# EAGLE design relay (EAGLE 5.12)
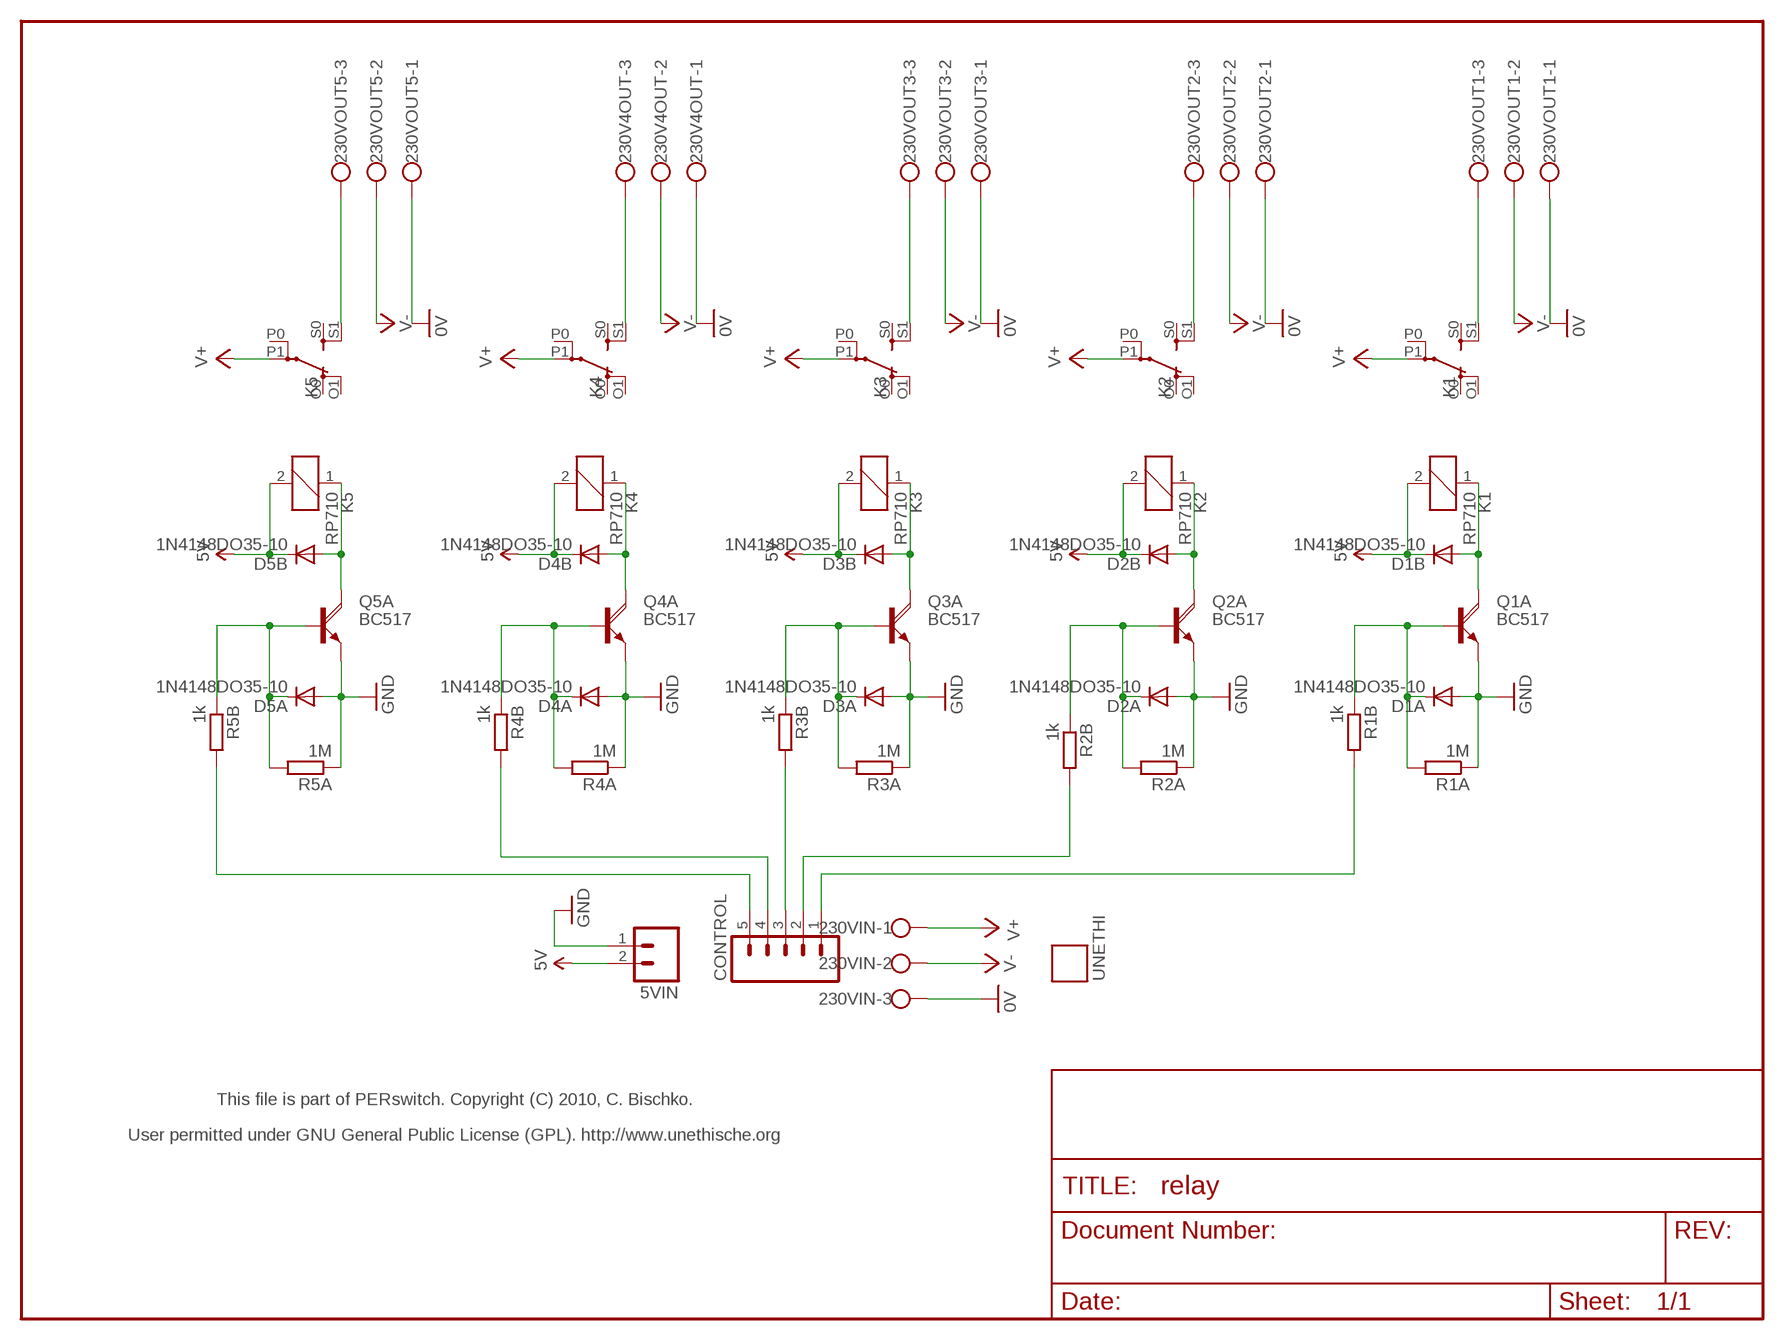
[diagram p0: schematic, sheet 1]

## Parts
5VIN  M02  [1X02_LONGPADS]
230V4OUT  W237-103  [W237-103]
230VIN  W237-103  [W237-103]
230VOUT1  W237-103  [W237-103]
230VOUT2  W237-103  [W237-103]
230VOUT3  W237-103  [W237-103]
230VOUT5  W237-103  [W237-103]
CONTROL  M05PTH_LONGPADS  [1X05_LONGPADS]
D1A  1N4148DO35-10  [DO35-10]
D1B  1N4148DO35-10  [DO35-10]
D2A  1N4148DO35-10  [DO35-10]
D2B  1N4148DO35-10  [DO35-10]
D3A  1N4148DO35-10  [DO35-10]
D3B  1N4148DO35-10  [DO35-10]
D4A  1N4148DO35-10  [DO35-10]
D4B  1N4148DO35-10  [DO35-10]
D5A  1N4148DO35-10  [DO35-10]
D5B  1N4148DO35-10  [DO35-10]
K1  RP710  [RP710]
K2  RP710  [RP710]
K3  RP710  [RP710]
K4  RP710  [RP710]
K5  RP710  [RP710]
Q1A  BC517  [SOT54A]
Q2A  BC517  [SOT54A]
Q3A  BC517  [SOT54A]
Q4A  BC517  [SOT54A]
Q5A  BC517  [SOT54A]
R1A  1M  R-EU_0207/10  [0207/10]
R1B  1k  R-EU_0207/10  [0207/10]
R2A  1M  R-EU_0207/10  [0207/10]
R2B  1k  R-EU_0207/10  [0207/10]
R3A  1M  R-EU_0207/10  [0207/10]
R3B  1k  R-EU_0207/10  [0207/10]
R4A  1M  R-EU_0207/10  [0207/10]
R4B  1k  R-EU_0207/10  [0207/10]
R5A  1M  R-EU_0207/10  [0207/10]
R5B  1k  R-EU_0207/10  [0207/10]
UNETHI  UNETHILOGO  [UNETHILOGO]

## Nets
0V: 230V4OUT.1 230VIN.3 230VOUT1.1 230VOUT2.1 230VOUT3.1 230VOUT5.1
5V: 5VIN.2 D1B.C D2B.C D3B.C D4B.C D5B.C K1.2 K2.2 K3.2 K4.2 K5.2
GND: 5VIN.1 D1A.A D2A.A D3A.A D4A.A D5A.A Q1A.E Q2A.E Q3A.E Q4A.E Q5A.E R1A.1 R2A.1 R3A.1 R4A.1 R5A.1
N$1: CONTROL.1 R1B.2
N$2: D5B.A K5.1 Q5A.C
N$3: CONTROL.2 R2B.2
N$4: D5A.C Q5A.B R5A.2 R5B.1
N$6: 230VOUT5.3 K5.S1(2:S)
N$7: D1B.A K1.1 Q1A.C
N$8: D1A.C Q1A.B R1A.2 R1B.1
N$10: 230VOUT1.3 K1.S1(2:S)
N$11: D2B.A K2.1 Q2A.C
N$12: D2A.C Q2A.B R2A.2 R2B.1
N$14: 230VOUT2.3 K2.S1(2:S)
N$15: D3B.A K3.1 Q3A.C
N$16: D3A.C Q3A.B R3A.2 R3B.1
N$18: 230VOUT3.3 K3.S1(2:S)
N$19: D4B.A K4.1 Q4A.C
N$20: D4A.C Q4A.B R4A.2 R4B.1
N$22: 230V4OUT.3 K4.S1(2:S)
N$23: CONTROL.3 R3B.2
N$24: CONTROL.4 R4B.2
N$25: CONTROL.5 R5B.2
V+: 230VIN.1 K1.P1(2:P) K2.P1(2:P) K3.P1(2:P) K4.P1(2:P) K5.P1(2:P)
V-: 230V4OUT.2 230VIN.2 230VOUT1.2 230VOUT2.2 230VOUT3.2 230VOUT5.2
Unconnected: K1.O0(2:O) K1.O1(2:O) K1.P0(2:P) K1.S0(2:S) K2.O0(2:O) K2.O1(2:O) K2.P0(2:P) K2.S0(2:S) K3.O0(2:O) K3.O1(2:O) K3.P0(2:P) K3.S0(2:S) K4.O0(2:O) K4.O1(2:O) K4.P0(2:P) K4.S0(2:S) K5.O0(2:O) K5.O1(2:O) K5.P0(2:P) K5.S0(2:S)

## Notes on the sheet
- This file is part of PERswitch. Copyright (C) 2010, C. Bischko.
- User permitted under GNU General Public License (GPL). http://www.unethische.org

## Library data of the parts
5VIN = SparkFun:M02: Header 2 Standard 2-pin 0.1" header. Use with straight break away headers (SKU : PRT-00116), right angle break away headers (PRT-00553), swiss pins (PRT-00743), machine pins (PRT-00117), and female headers (PRT-00115). Molex polarized connector foot print use with SKU : PRT-08233 with associated crimp pins and housings.
230V4OUT 230VIN 230VOUT1-230VOUT3 230VOUT5 = con-wago-500:W237-103: WAGO SCREW CLAMP
CONTROL = SparkFun:M05: Header 5 Standard 5-pin 0.1" header. Use with straight break away headers (SKU : PRT-00116), right angle break away headers (PRT-00553), swiss pins (PRT-00743), machine pins (PRT-00117), and female headers (PRT-00115). Molex polarized connector foot print use with SKU : PRT-08230 with associated crimp pins and housings.
D1A D1B D2A D2B D3A D3B D4A D4B D5A D5B = diode:1N4148: DIODE high speed (Philips)
K1-K5 = relay:RP710: RELAY 2 x switch, Schrack
Q1A Q2A Q3A Q4A Q5A = transistor-small-signal:BC517: NPN DARLINGTON TRANSISTOR
R1A R1B R2A R2B R3A R3B R4A R4B R5A R5B = resistor:R-EU_: RESISTOR, European symbol
UNETHI = unethilogo:UNETHILOGO: UNETHI_LOGO

## Board
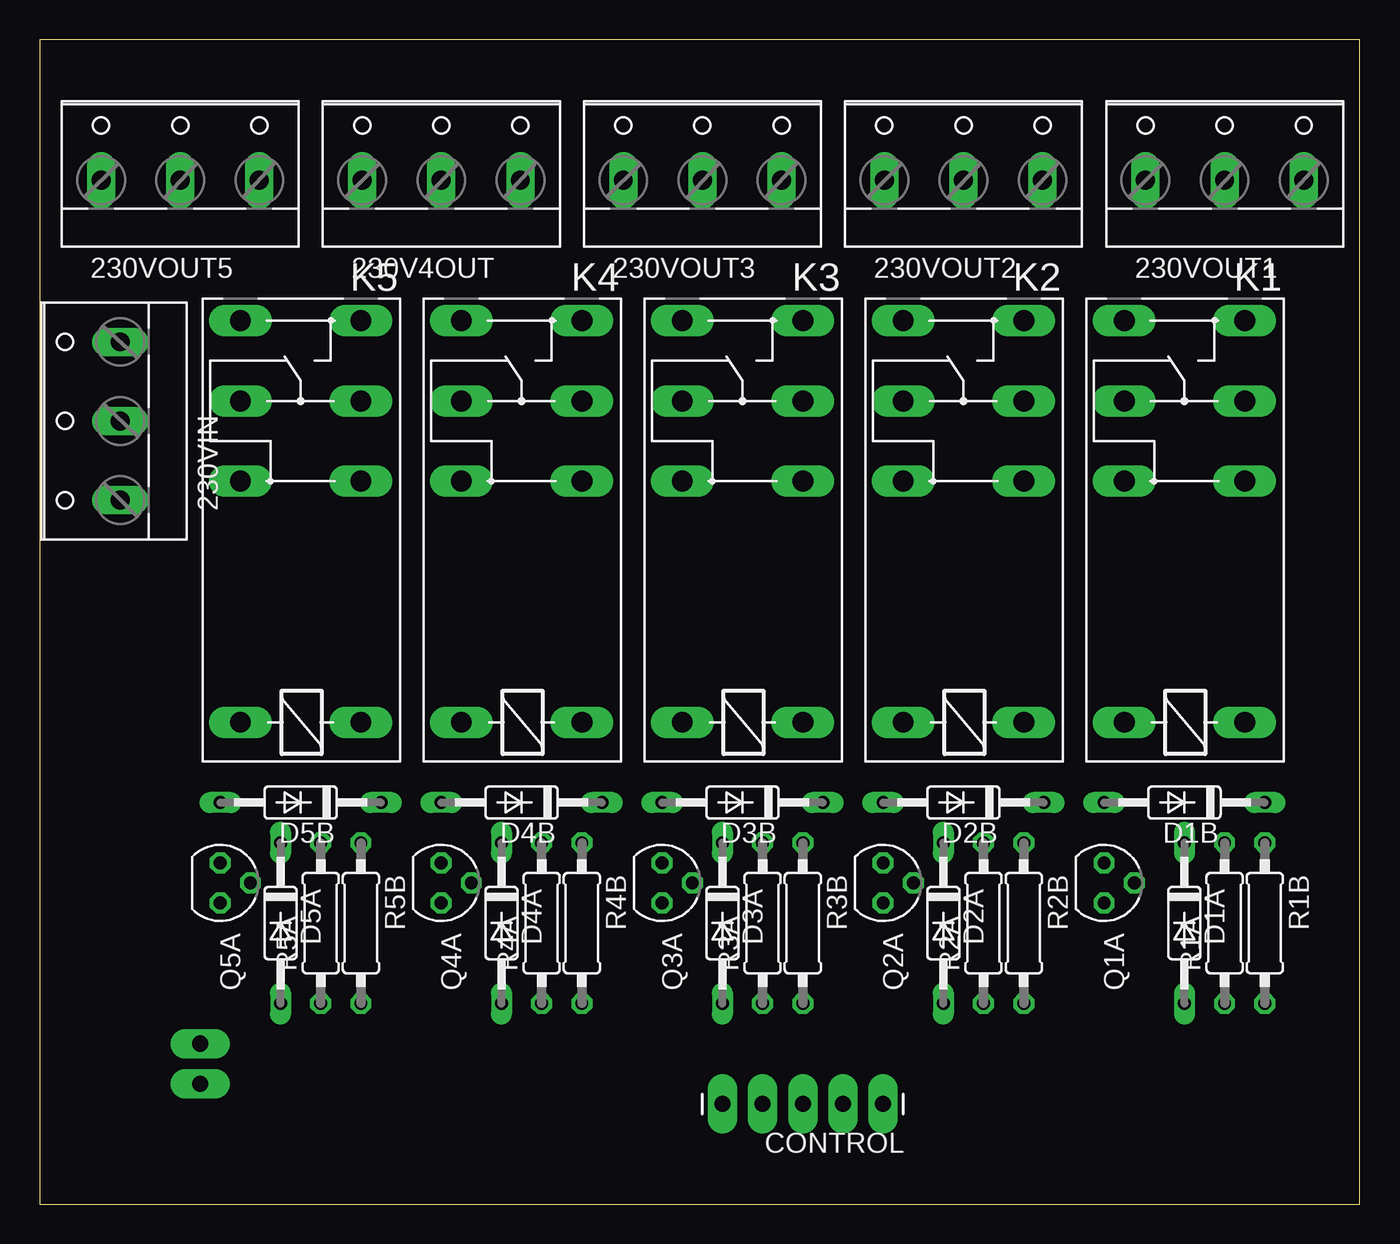
[diagram p1: board, top side]
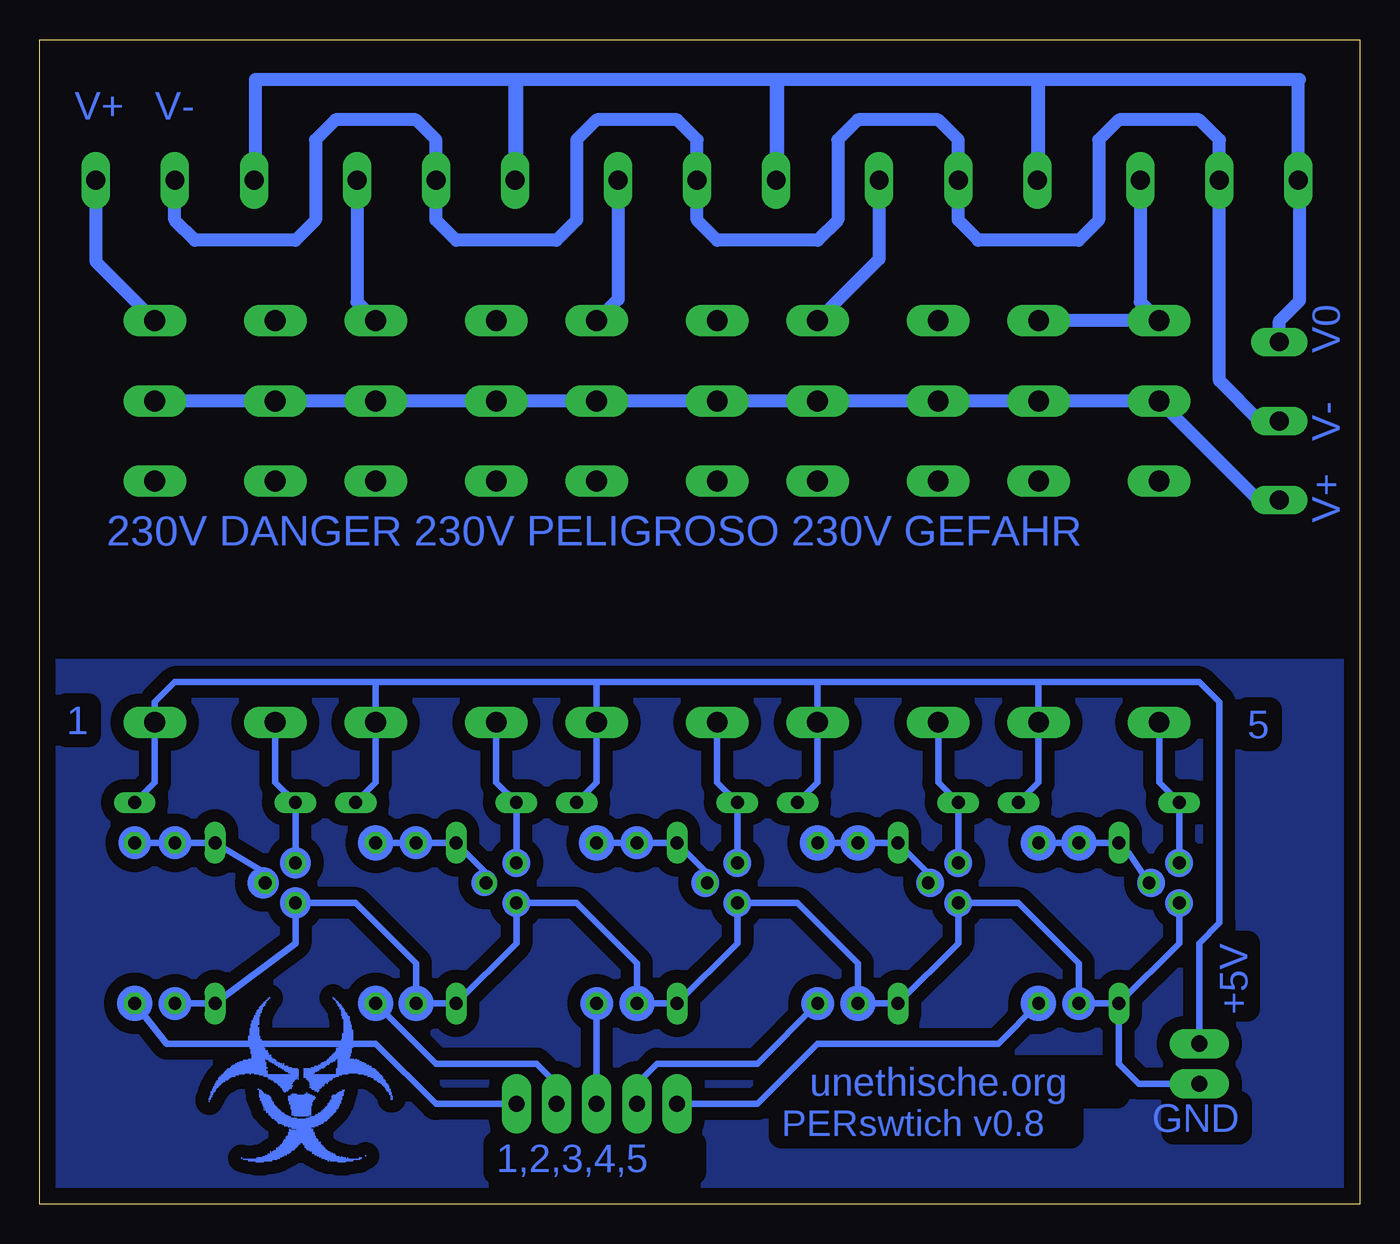
[diagram p2: board, bottom side, seen from below]

Size 83.49 x 73.65 mm. Coordinates in mm from the lower left corner, seen from the top.
Outline: 0,0 83.49,0 83.49,73.65 0,73.65 0,0
Copper layers (1*16): Top 0.035mm / dielectric 1.5mm / Bottom 0.035mm
Design rules "default": minimum track width 10mil, minimum drill 24mil, track to track 8mil, track to pad 8mil, pad to pad 8mil, via to via 8mil, smd to smd 8mil, copper to edge 40mil, drill to drill 8mil, minimum pad ring 10mil, minimum via ring 8mil, stop-mask expansion 4mil, vias tented up to drill 0mil, thermal gap 10mil

### Footprints (pad centres in the part's own frame; a part is rotated, then mirrored left to right if it is on the bottom)
1X02_LONGPADS = drill 1.016 pad 1.88 long: 1 0,0; 2 2.54,0
W237-103 = drill 1.194 long: 1 -5,-1.29; 2 0,-1.29; 3 5,-1.29
1X05_LONGPADS = drill 1.016 pad 1.88 long: 1 0,0; 2 2.54,0; 3 5.08,0; 4 7.62,0; 5 10.16,0
DO35-10 = drill 0.813 long: A 5.08,0; C -5.08,0
RP710 = drill 1.321 long: 1 -3.81,3.81; 2 -3.81,-3.81; O0 11.43,3.81; O1 11.43,-3.81; P0 16.51,3.81; P1 16.51,-3.81; S0 21.59,3.81; S1 21.59,-3.81
SOT54A = drill 0.813 octagon: B 0,1.905; C -1.27,0; E 1.27,0
0207/10 = drill 0.813 octagon: 1 -5.08,0; 2 5.08,0

### Placement (x,y rotation side)
5VIN  10.16,7.62 90 top
230V4OUT  25.4,66.04 0 top
230VIN  3.81,49.53 90 top
230VOUT1  74.93,66.04 0 top
230VOUT2  58.42,66.04 0 top
230VOUT3  41.91,66.04 0 top
230VOUT5  8.89,66.04 0 top
CONTROL  53.34,6.35 180 top
D1A  72.39,17.78 270 top
D1B  72.39,25.4 180 top
D2A  57.15,17.78 270 top
D2B  58.42,25.4 180 top
D3A  43.18,17.78 270 top
D3B  44.45,25.4 180 top
D4A  29.21,17.78 270 top
D4B  30.48,25.4 180 top
D5A  15.24,17.78 270 top
D5B  16.51,25.4 180 top
K1  72.39,34.29 90 top
K2  58.42,34.29 90 top
K3  44.45,34.29 90 top
K4  30.48,34.29 90 top
K5  16.51,34.29 90 top
Q1A  67.31,20.32 270 top
Q2A  53.34,20.32 270 top
Q3A  39.37,20.32 270 top
Q4A  25.4,20.32 270 top
Q5A  11.43,20.32 270 top
R1A  74.93,17.78 90 top
R1B  77.47,17.78 270 top
R2A  59.69,17.78 90 top
R2B  62.23,17.78 270 top
R3A  45.72,17.78 90 top
R3B  48.26,17.78 270 top
R4A  31.75,17.78 90 top
R4B  34.29,17.78 270 top
R5A  17.78,17.78 90 top
R5B  20.32,17.78 270 top
UNETHI  60.96,2.54 0 top

### Tracks (layer width: path | path; a pad name or v marks a point on that pad's centre or on a via)
0V
  Bottom 0.813: 230VIN.3 5.1,55.86 3.81,57.15 3.81,64.67 230VOUT5.1 3.89,71.04 3.81,71.12 20.32,71.12 | 20.32,71.12 20.32,64.83 230V4OUT.1 20.4,71.04 20.32,71.12 | 20.32,71.12 36.83,71.12 | 36.83,71.12 36.83,64.83 230VOUT3.1 36.91,71.04 36.83,71.12 | 36.83,71.12 53.34,71.12 | 53.34,71.12 53.34,64.83 230VOUT2.1 53.42,71.04 53.34,71.12 | 53.34,71.12 69.85,71.12 69.85,64.83 230VOUT1.1
5V
  Bottom 0.406: 34.29,33.02 K4.2 34.29,26.67 D4B.C | 20.32,33.02 34.29,33.02 | 20.32,33.02 K5.2 20.32,26.67 D5B.C | 48.26,33.02 K3.2 48.26,26.67 D3B.C | 34.29,33.02 48.26,33.02 | 62.23,33.02 K2.2 62.23,26.67 D2B.C | 48.26,33.02 62.23,33.02 | 62.23,33.02 74.93,33.02 76.2,31.75 K1.2 76.2,26.67 D1B.C | 5VIN.2 10.16,16.51 8.89,17.78 8.89,31.75 10.16,33.02 20.32,33.02
GND
  Bottom 0.406: D5A.A R5A.1 17.78,15.24 21.59,19.05 Q4A.E 25.4,16.51 D4A.A R4A.1 31.75,15.24 35.56,19.05 Q3A.E 39.37,16.51 D3A.A R3A.1 45.72,15.24 49.53,19.05 Q2A.E 53.34,16.51 D2A.A R2A.1 59.69,15.24 63.5,19.05 Q1A.E 67.31,16.51 D1A.A R1A.1 | 5VIN.1 13.97,7.62 15.24,8.89 D5A.A | Q5A.E 11.43,16.51 D5A.A
N$1
  Bottom 0.406: CONTROL.1 58.42,6.35 62.23,10.16 75.44,10.16 R1B.2
N$2
  Bottom 0.406: Q5A.C D5B.A 12.7,26.67 K5.1
N$3
  Bottom 0.406: CONTROL.2 50.8,7.62 52.07,8.89 58.42,8.89 R2B.2
N$4
  Bottom 0.406: Q5A.B 14.61,22.23 D5A.C R5A.2 R5B.1
N$6
  Bottom 0.813: 230VOUT5.3 13.89,57.07 12.7,55.88 K5.S1
N$7
  Bottom 0.406: Q1A.C D1B.A 68.58,26.67 K1.1
N$8
  Bottom 0.406: R1B.1 R1A.2 D1A.C 69.22,20.95 Q1A.B
N$10
  Bottom 0.813: 230VOUT1.3 79.93,59.61 K1.S1
N$11
  Bottom 0.406: Q2A.C D2B.A 54.61,26.67 K2.1
N$12
  Bottom 0.406: Q2A.B 55.24,20.95 D2A.C R2B.1 R2A.2
N$14
  Bottom 0.813: 230VOUT2.3 63.42,57.07 K2.S1
N$15
  Bottom 0.406: Q3A.C D3B.A 40.64,26.67 K3.1
N$16
  Bottom 0.406: R3B.1 R3A.2 D3A.C 41.27,20.95 Q3A.B
N$18
  Bottom 0.813: 230VOUT3.3 46.91,57.23 K3.S1
N$19
  Bottom 0.406: Q4A.C D4B.A 26.67,26.67 K4.1
N$20
  Bottom 0.406: R4B.1 R4A.2 D4A.C 27.3,20.95 Q4A.B
N$22
  Bottom 0.813: 230V4OUT.3 30.4,59.77 K4.S1
N$23
  Bottom 0.406: R3B.2 CONTROL.3
N$24
  Bottom 0.406: CONTROL.4 45.72,7.62 44.45,8.89 38.1,8.89 R4B.2
N$25
  Bottom 0.406: CONTROL.5 38.1,6.35 34.29,10.16 22.86,10.16 R5B.2
N$26
  pour Bottom (isolate 0.813): 0,34.29 83.57,34.29 83.57,0 0,0
V+
  Bottom 0.813: K1.P1 K2.P1 K3.P1 K4.P1 K5.P1 12.7,50.8 6.43,44.53 230VIN.1
V-
  Bottom 0.813: 230VIN.2 6.35,49.53 8.89,52.07 230VOUT5.2 8.89,67.31 10.16,68.58 15.24,68.58 16.51,67.31 16.51,62.23 17.78,60.96 24.13,60.96 25.4,62.23 230V4OUT.2 25.4,67.31 26.67,68.58 31.75,68.58 33.02,67.31 33.02,62.23 34.29,60.96 40.64,60.96 41.91,62.23 230VOUT3.2 41.91,67.31 43.18,68.58 48.26,68.58 49.53,67.31 49.53,62.23 50.8,60.96 57.15,60.96 58.42,62.23 230VOUT2.2 58.42,67.31 59.69,68.58 64.77,68.58 66.04,67.31 66.04,62.23 67.31,60.96 73.66,60.96 74.93,62.23 230VOUT1.2
(copper drawn outside any net)
  shapes: Bottom circle x36

### Text on the board
Bottom: V- | V+ | V0 | V- | V+ | 230V DANGER 230V PELIGROSO 230V GEFAHR | 1 | 5 | +5V | unethische.org | GND | PERswtich v0.8 | 1,2,3,4,5
Document: 230V DANGER 230V PELIGROSO 230V GEFAHR | V0 V+ V- | V0 | V+ | +5V | GND | 5 4 3 2 1